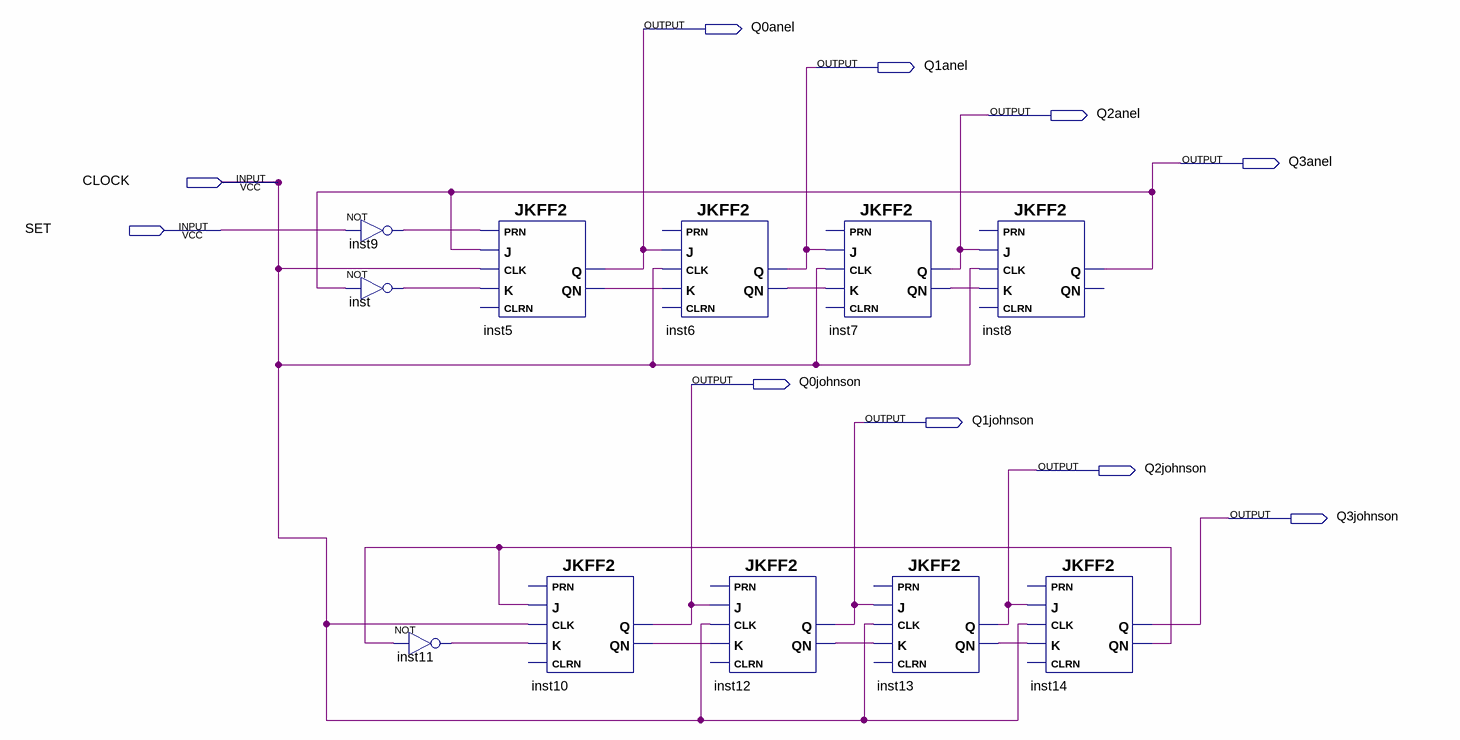
[diagram p0: schematic sheet]
// Quartus schematic ex1.bdf as structural Verilog: 11 symbols, 10 pins
module ex1 (
  input  CLOCK,
  input  SET,
  output Q0anel,
  output Q1anel,
  output Q2anel,
  output Q3anel,
  output Q0johnson,
  output Q1johnson,
  output Q2johnson,
  output Q3johnson
);

  wire inst5_qn, inst6_qn, inst7_qn, inst9_out, inst10_qn, inst11_out, inst12_qn, inst13_qn, inst14_qn,
       inst_out;

  not inst9 (inst9_out, SET);
  not inst (inst_out, Q3anel);
  not inst11 (inst11_out, inst14_qn);
  JKFF2 inst5 (.K(inst_out), .CLK(CLOCK), .PRN(inst9_out), .J(Q3anel), .QN(inst5_qn), .Q(Q0anel));  // open: CLRN
  JKFF2 inst10 (.K(inst11_out), .CLK(CLOCK), .J(inst14_qn), .QN(inst10_qn), .Q(Q0johnson));  // open: CLRN, PRN
  JKFF2 inst6 (.K(inst5_qn), .CLK(CLOCK), .J(Q0anel), .QN(inst6_qn), .Q(Q1anel));  // open: CLRN, PRN
  JKFF2 inst12 (.K(inst10_qn), .CLK(CLOCK), .J(Q0johnson), .QN(inst12_qn), .Q(Q1johnson));  // open: CLRN, PRN
  JKFF2 inst7 (.K(inst6_qn), .CLK(CLOCK), .J(Q1anel), .QN(inst7_qn), .Q(Q2anel));  // open: CLRN, PRN
  JKFF2 inst13 (.K(inst12_qn), .CLK(CLOCK), .J(Q1johnson), .QN(inst13_qn), .Q(Q2johnson));  // open: CLRN, PRN
  JKFF2 inst8 (.K(inst7_qn), .CLK(CLOCK), .J(Q2anel), .Q(Q3anel));  // open: CLRN, PRN, QN
  JKFF2 inst14 (.K(inst13_qn), .CLK(CLOCK), .J(Q2johnson), .QN(inst14_qn), .Q(Q3johnson));  // open: CLRN, PRN
endmodule
